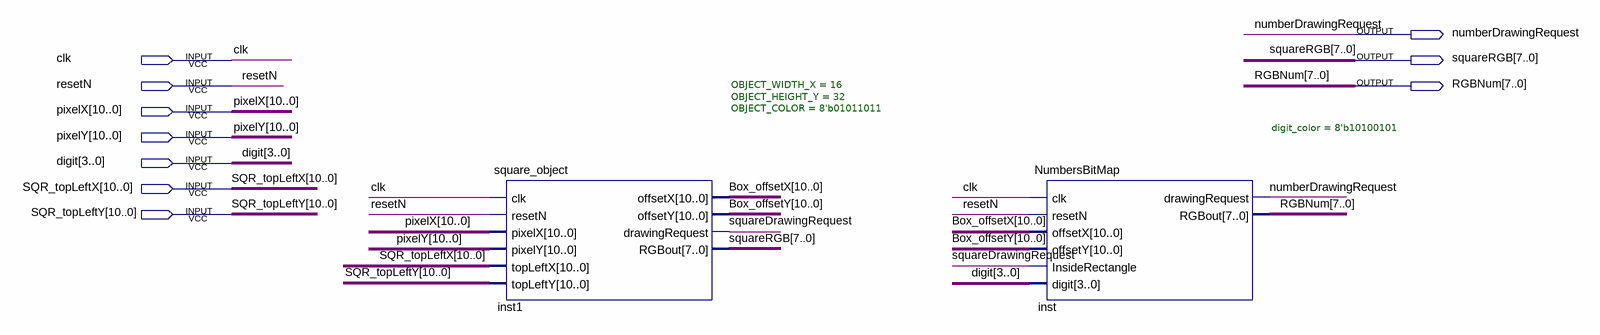
[diagram p0: schematic sheet]
// Quartus schematic DigitOnScrean.bdf as structural Verilog: 2 symbols, 10 pins
module DigitOnScrean (
  input  clk,
  input  resetN,
  input  [10:0] pixelX,
  input  [10:0] pixelY,
  input  [3:0] digit,
  input  [10:0] SQR_topLeftX,
  input  [10:0] SQR_topLeftY,
  output numberDrawingRequest,
  output [7:0] squareRGB,
  output [7:0] RGBNum
);

  wire squareDrawingRequest;
  wire [10:0] Box_offsetX, Box_offsetY;

  square_object #(.OBJECT_WIDTH_X(16), .OBJECT_HEIGHT_Y(32), .OBJECT_COLOR(8'b01011011)) inst1 (
    .clk(clk), .resetN(resetN), .pixelX(pixelX), .pixelY(pixelY), .topLeftX(SQR_topLeftX),
    .topLeftY(SQR_topLeftY), .offsetX(Box_offsetX), .offsetY(Box_offsetY),
    .drawingRequest(squareDrawingRequest), .RGBout(squareRGB));
  NumbersBitMap #(.digit_color(8'b10100101)) inst (
    .clk(clk), .resetN(resetN), .offsetX(Box_offsetX), .offsetY(Box_offsetY),
    .InsideRectangle(squareDrawingRequest), .digit(digit), .drawingRequest(numberDrawingRequest),
    .RGBout(RGBNum));
endmodule
